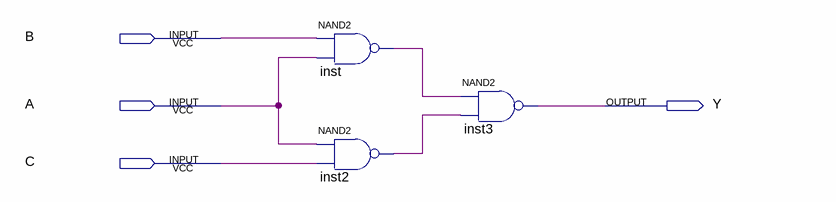
[diagram p0: schematic sheet]
// Quartus schematic JUDGE.bdf as structural Verilog: 3 symbols, 4 pins
module JUDGE (
  input  B,
  input  A,
  input  C,
  output Y
);

  wire inst2_out, inst_out;

  nand inst (inst_out, B, A);
  nand inst2 (inst2_out, A, C);
  nand inst3 (Y, inst_out, inst2_out);
endmodule
